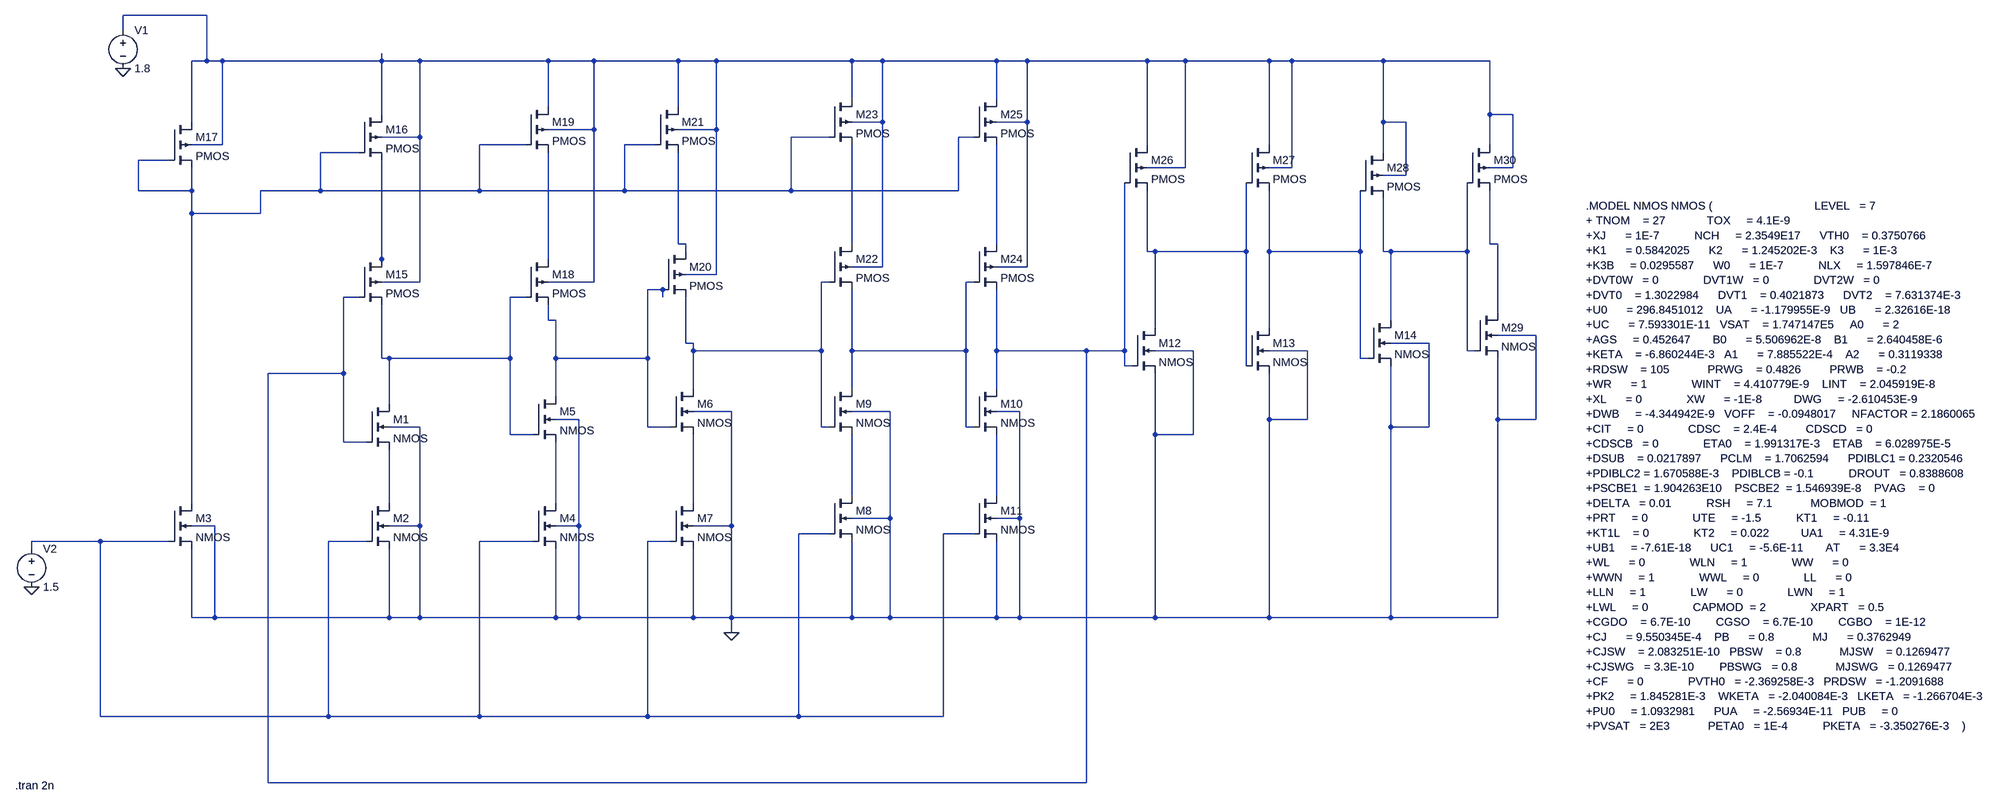
[diagram p0: schematic VLSI_project.asc]
VLSI_project.asc, the LTspice schematic file:
Version 4
SHEET 1 3892 984
WIRE -336 -704 -512 -704
WIRE -512 -672 -512 -704
WIRE -336 -608 -336 -704
WIRE -336 -608 -368 -608
WIRE -304 -608 -336 -608
WIRE 32 -608 32 -624
WIRE 32 -608 -304 -608
WIRE 112 -608 32 -608
WIRE 448 -608 112 -608
WIRE 544 -608 448 -608
WIRE 720 -608 544 -608
WIRE 800 -608 720 -608
WIRE 1088 -608 800 -608
WIRE 1152 -608 1088 -608
WIRE 1408 -608 1152 -608
WIRE 1472 -608 1408 -608
WIRE 1744 -608 1472 -608
WIRE 1824 -608 1744 -608
WIRE 2096 -608 1824 -608
WIRE 2144 -608 2096 -608
WIRE 2400 -608 2144 -608
WIRE 2624 -608 2400 -608
WIRE 1088 -528 1088 -608
WIRE 1408 -528 1408 -608
WIRE 448 -512 448 -608
WIRE 720 -512 720 -608
WIRE 32 -496 32 -608
WIRE 2624 -496 2624 -608
WIRE 2672 -496 2624 -496
WIRE -368 -480 -368 -608
WIRE 1152 -480 1152 -608
WIRE 1152 -480 1088 -480
WIRE 1472 -480 1472 -608
WIRE 1472 -480 1408 -480
WIRE 2400 -480 2400 -608
WIRE 2448 -480 2400 -480
WIRE 544 -464 544 -608
WIRE 544 -464 448 -464
WIRE 800 -464 800 -608
WIRE 800 -464 720 -464
WIRE 112 -448 112 -608
WIRE 112 -448 32 -448
WIRE 1040 -448 960 -448
WIRE 1360 -448 1328 -448
WIRE -304 -432 -304 -608
WIRE -304 -432 -368 -432
WIRE 400 -432 304 -432
WIRE 672 -432 608 -432
WIRE 1744 -432 1744 -608
WIRE 2096 -432 2096 -608
WIRE 2624 -432 2624 -496
WIRE -16 -416 -96 -416
WIRE 2400 -416 2400 -480
WIRE -416 -400 -480 -400
WIRE 1824 -384 1824 -608
WIRE 1824 -384 1744 -384
WIRE 2144 -384 2144 -608
WIRE 2144 -384 2096 -384
WIRE 2672 -384 2672 -496
WIRE 2672 -384 2624 -384
WIRE 2448 -368 2448 -480
WIRE 2448 -368 2400 -368
WIRE -480 -336 -480 -400
WIRE -368 -336 -368 -384
WIRE -368 -336 -480 -336
WIRE -96 -336 -96 -416
WIRE -96 -336 -224 -336
WIRE 304 -336 304 -432
WIRE 304 -336 -96 -336
WIRE 608 -336 608 -432
WIRE 608 -336 304 -336
WIRE 960 -336 960 -448
WIRE 960 -336 608 -336
WIRE 1328 -336 1328 -448
WIRE 1328 -336 960 -336
WIRE -368 -288 -368 -336
WIRE -224 -288 -224 -336
WIRE -224 -288 -368 -288
WIRE 720 -224 720 -416
WIRE 736 -224 720 -224
WIRE 1088 -224 1088 -432
WIRE 1408 -224 1408 -432
WIRE 2624 -224 2624 -336
WIRE 2640 -224 2624 -224
WIRE 736 -208 736 -224
WIRE 1744 -208 1744 -336
WIRE 1760 -208 1744 -208
WIRE 2048 -208 2048 -352
WIRE 2048 -208 1760 -208
WIRE 2096 -208 2096 -336
WIRE 2352 -208 2352 -336
WIRE 2352 -208 2096 -208
WIRE 2400 -208 2400 -320
WIRE 2416 -208 2400 -208
WIRE 2576 -208 2576 -352
WIRE 2576 -208 2416 -208
WIRE 32 -192 32 -400
WIRE 448 -192 448 -416
WIRE 32 -176 32 -192
WIRE 1152 -176 1152 -480
WIRE 1152 -176 1088 -176
WIRE 1472 -176 1472 -480
WIRE 1472 -176 1408 -176
WIRE 800 -160 800 -464
WIRE 800 -160 736 -160
WIRE 112 -144 112 -448
WIRE 112 -144 32 -144
WIRE 544 -144 544 -464
WIRE 544 -144 448 -144
WIRE 1040 -144 1024 -144
WIRE 1360 -144 1344 -144
WIRE 688 -128 656 -128
WIRE -16 -112 -48 -112
WIRE 400 -112 368 -112
WIRE 688 -112 688 -128
WIRE 2640 -80 2640 -224
WIRE 448 -64 448 -96
WIRE 464 -64 448 -64
WIRE 2416 -64 2416 -208
WIRE 1760 -48 1760 -208
WIRE 2096 -48 2096 -208
WIRE 2720 -32 2640 -32
WIRE 736 -16 736 -112
WIRE 752 -16 736 -16
WIRE 2496 -16 2416 -16
WIRE 752 0 752 -16
WIRE 1024 0 1024 -144
WIRE 1024 0 752 0
WIRE 1088 0 1088 -128
WIRE 1344 0 1344 -144
WIRE 1344 0 1088 0
WIRE 1408 0 1408 -128
WIRE 1616 0 1408 0
WIRE 1696 0 1696 -352
WIRE 1696 0 1616 0
WIRE 1840 0 1760 0
WIRE 2176 0 2096 0
WIRE 2576 0 2576 -208
WIRE 2592 0 2576 0
WIRE 32 16 32 -96
WIRE 48 16 32 16
WIRE 368 16 368 -112
WIRE 368 16 48 16
WIRE 464 16 464 -64
WIRE 656 16 656 -128
WIRE 656 16 464 16
WIRE 2352 16 2352 -208
WIRE 2368 16 2352 16
WIRE 1696 32 1696 0
WIRE 1712 32 1696 32
WIRE 2048 32 2048 -208
WIRE -48 48 -48 -112
WIRE -48 48 -208 48
WIRE 752 80 752 0
WIRE 1088 80 1088 0
WIRE 1408 80 1408 0
WIRE 464 96 464 16
WIRE 48 112 48 16
WIRE 832 128 752 128
WIRE 1168 128 1088 128
WIRE 1456 128 1408 128
WIRE 512 144 464 144
WIRE 2096 144 2096 48
WIRE 2176 144 2176 0
WIRE 2176 144 2096 144
WIRE 2640 144 2640 16
WIRE 2720 144 2720 -32
WIRE 2720 144 2640 144
WIRE 112 160 48 160
WIRE 656 160 656 16
WIRE 704 160 656 160
WIRE 1024 160 1024 0
WIRE 1040 160 1024 160
WIRE 1344 160 1344 0
WIRE 1360 160 1344 160
WIRE 2416 160 2416 32
WIRE 2496 160 2496 -16
WIRE 2496 160 2416 160
WIRE 368 176 368 16
WIRE 416 176 368 176
WIRE 1760 176 1760 48
WIRE 1840 176 1840 0
WIRE 1840 176 1760 176
WIRE -48 192 -48 48
WIRE 0 192 -48 192
WIRE 1088 304 1088 176
WIRE 1408 304 1408 176
WIRE -368 320 -368 -288
WIRE 48 320 48 208
WIRE 464 320 464 192
WIRE 752 320 752 176
WIRE 1168 352 1168 128
WIRE 1168 352 1088 352
WIRE 1456 352 1456 128
WIRE 1456 352 1408 352
WIRE -320 368 -368 368
WIRE 112 368 112 160
WIRE 112 368 48 368
WIRE 512 368 512 144
WIRE 512 368 464 368
WIRE 832 368 832 128
WIRE 832 368 752 368
WIRE 1040 384 976 384
WIRE 1360 384 1296 384
WIRE -560 400 -704 400
WIRE -416 400 -560 400
WIRE 0 400 -80 400
WIRE 416 400 304 400
WIRE 704 400 656 400
WIRE -704 416 -704 400
WIRE -368 560 -368 416
WIRE -320 560 -320 368
WIRE -320 560 -368 560
WIRE 48 560 48 416
WIRE 48 560 -320 560
WIRE 112 560 112 368
WIRE 112 560 48 560
WIRE 464 560 464 416
WIRE 464 560 112 560
WIRE 512 560 512 368
WIRE 512 560 464 560
WIRE 752 560 752 416
WIRE 752 560 512 560
WIRE 832 560 832 368
WIRE 832 560 752 560
WIRE 1088 560 1088 400
WIRE 1088 560 832 560
WIRE 1168 560 1168 352
WIRE 1168 560 1088 560
WIRE 1408 560 1408 400
WIRE 1408 560 1168 560
WIRE 1456 560 1456 352
WIRE 1456 560 1408 560
WIRE 1760 560 1760 176
WIRE 1760 560 1456 560
WIRE 2096 560 2096 144
WIRE 2096 560 1760 560
WIRE 2416 560 2416 160
WIRE 2416 560 2096 560
WIRE 2640 560 2640 144
WIRE 2640 560 2416 560
WIRE 832 592 832 560
WIRE -560 768 -560 400
WIRE -80 768 -80 400
WIRE -80 768 -560 768
WIRE 304 768 304 400
WIRE 304 768 -80 768
WIRE 656 768 656 400
WIRE 656 768 304 768
WIRE 976 768 976 384
WIRE 976 768 656 768
WIRE 1296 768 1296 384
WIRE 1296 768 976 768
WIRE -208 960 -208 48
WIRE 1616 960 1616 0
WIRE 1616 960 -208 960
FLAG -704 496 0
FLAG -512 -592 0
FLAG 832 592 0
SYMBOL nmos4 0 112 R0
SYMATTR InstName M1
SYMATTR Value2 l=180n w=180n
SYMBOL nmos4 0 320 R0
SYMATTR InstName M2
SYMATTR Value2 l=180n w=180n
SYMBOL nmos4 -416 320 R0
SYMATTR InstName M3
SYMATTR Value2 l=180n w=180n
SYMBOL nmos4 416 320 R0
SYMATTR InstName M4
SYMATTR Value2 l=180n w=180n
SYMBOL nmos4 416 96 R0
SYMATTR InstName M5
SYMATTR Value2 l=180n w=180n
SYMBOL nmos4 704 80 R0
SYMATTR InstName M6
SYMATTR Value2 l=180n w=180n
SYMBOL nmos4 704 320 R0
SYMATTR InstName M7
SYMATTR Value2 l=180n w=180n
SYMBOL nmos4 1040 304 R0
SYMATTR InstName M8
SYMATTR Value2 l=180n w=180n
SYMBOL nmos4 1040 80 R0
SYMATTR InstName M9
SYMATTR Value2 l=180n w=180n
SYMBOL nmos4 1360 80 R0
SYMATTR InstName M10
SYMATTR Value2 l=180n w=180n
SYMBOL nmos4 1360 304 R0
SYMATTR InstName M11
SYMATTR Value2 l=180n w=180n
SYMBOL nmos4 1712 -48 R0
SYMATTR InstName M12
SYMATTR Value2 l=180n w=180n
SYMBOL nmos4 2048 -48 R0
SYMATTR InstName M13
SYMATTR Value2 l=180n w=180n
SYMBOL nmos4 2368 -64 R0
SYMATTR InstName M14
SYMATTR Value2 l=180n w=180n
SYMBOL pmos4 -16 -192 R0
SYMATTR InstName M15
SYMATTR Value2 l=180n w=450n
SYMBOL pmos4 -16 -496 R0
SYMATTR InstName M16
SYMATTR Value2 l=180n w=450n
SYMBOL pmos4 -416 -480 R0
SYMATTR InstName M17
SYMATTR Value2 l=180n w=450n
SYMBOL pmos4 400 -192 R0
SYMATTR InstName M18
SYMATTR Value2 l=180n w=450n
SYMBOL pmos4 400 -512 R0
SYMATTR InstName M19
SYMATTR Value2 l=180n w=450n
SYMBOL pmos4 688 -208 R0
SYMATTR InstName M20
SYMATTR Value2 l=180n w=450n
SYMBOL pmos4 672 -512 R0
SYMATTR InstName M21
SYMATTR Value2 l=180n w=450n
SYMBOL pmos4 1040 -224 R0
SYMATTR InstName M22
SYMBOL pmos4 1040 -528 R0
SYMATTR InstName M23
SYMATTR Value2 l=180n w=450n
SYMBOL pmos4 1360 -224 R0
SYMATTR InstName M24
SYMATTR Value2 l=180n w=450n
SYMBOL pmos4 1360 -528 R0
SYMATTR InstName M25
SYMATTR Value2 l=180n w=450n
SYMBOL pmos4 1696 -432 R0
SYMATTR InstName M26
SYMATTR Value2 l=180n w=450n
SYMBOL pmos4 2048 -432 R0
SYMATTR InstName M27
SYMATTR Value2 l=180n w=450n
SYMBOL pmos4 2352 -416 R0
SYMATTR InstName M28
SYMATTR Value2 l=180n w=450n
SYMBOL voltage -512 -688 R0
WINDOW 123 0 0 Left 0
WINDOW 39 0 0 Left 0
SYMATTR InstName V1
SYMATTR Value 1.8
SYMBOL voltage -704 400 R0
WINDOW 123 0 0 Left 0
WINDOW 39 0 0 Left 0
SYMATTR InstName V2
SYMATTR Value 1.5
SYMBOL nmos4 2592 -80 R0
SYMATTR InstName M29
SYMATTR Value2 l=180n w=180n
SYMBOL pmos4 2576 -432 R0
SYMATTR InstName M30
SYMATTR Value2 l=180n w=450n
TEXT -738 966 Left 2 !.tran 2n
TEXT 3000 -304 Left 2 !.MODEL NMOS NMOS (                                LEVEL   = 7\n+ TNOM    = 27             TOX     = 4.1E-9  \n+XJ      = 1E-7           NCH     = 2.3549E17      VTH0    = 0.3750766\n+K1      = 0.5842025      K2      = 1.245202E-3    K3      = 1E-3\n+K3B     = 0.0295587      W0      = 1E-7           NLX     = 1.597846E-7\n+DVT0W   = 0              DVT1W   = 0              DVT2W   = 0\n+DVT0    = 1.3022984      DVT1    = 0.4021873      DVT2    = 7.631374E-3\n+U0      = 296.8451012    UA      = -1.179955E-9   UB      = 2.32616E-18\n+UC      = 7.593301E-11   VSAT    = 1.747147E5     A0      = 2\n+AGS     = 0.452647       B0      = 5.506962E-8    B1      = 2.640458E-6\n+KETA    = -6.860244E-3   A1      = 7.885522E-4    A2      = 0.3119338\n+RDSW    = 105            PRWG    = 0.4826         PRWB    = -0.2\n+WR      = 1              WINT    = 4.410779E-9    LINT    = 2.045919E-8\n+XL      = 0              XW      = -1E-8          DWG     = -2.610453E-9\n+DWB     = -4.344942E-9   VOFF    = -0.0948017     NFACTOR = 2.1860065\n+CIT     = 0              CDSC    = 2.4E-4         CDSCD   = 0\n+CDSCB   = 0              ETA0    = 1.991317E-3    ETAB    = 6.028975E-5\n+DSUB    = 0.0217897      PCLM    = 1.7062594      PDIBLC1 = 0.2320546\n+PDIBLC2 = 1.670588E-3    PDIBLCB = -0.1           DROUT   = 0.8388608\n+PSCBE1  = 1.904263E10    PSCBE2  = 1.546939E-8    PVAG    = 0\n+DELTA   = 0.01           RSH     = 7.1            MOBMOD  = 1\n+PRT     = 0              UTE     = -1.5           KT1     = -0.11\n+KT1L    = 0              KT2     = 0.022          UA1     = 4.31E-9\n+UB1     = -7.61E-18      UC1     = -5.6E-11       AT      = 3.3E4\n+WL      = 0              WLN     = 1              WW      = 0\n+WWN     = 1              WWL     = 0              LL      = 0\n+LLN     = 1              LW      = 0              LWN     = 1\n+LWL     = 0              CAPMOD  = 2              XPART   = 0.5\n+CGDO    = 6.7E-10        CGSO    = 6.7E-10        CGBO    = 1E-12\n+CJ      = 9.550345E-4    PB      = 0.8            MJ      = 0.3762949\n+CJSW    = 2.083251E-10   PBSW    = 0.8            MJSW    = 0.1269477\n+CJSWG   = 3.3E-10        PBSWG   = 0.8            MJSWG   = 0.1269477\n+CF      = 0              PVTH0   = -2.369258E-3   PRDSW   = -1.2091688\n+PK2     = 1.845281E-3    WKETA   = -2.040084E-3   LKETA   = -1.266704E-3\n+PU0     = 1.0932981      PUA     = -2.56934E-11   PUB     = 0\n+PVSAT   = 2E3            PETA0   = 1E-4           PKETA   = -3.350276E-3    )

The netlist it stands for:
* VLSI_project.asc
M1 N016 N015 N019 0 NMOS l=180n w=180n
M2 N019 N022 0 0 NMOS l=180n w=180n
M3 N002 N022 0 0 NMOS l=180n w=180n
M4 N020 N022 0 0 NMOS l=180n w=180n
M5 N014 N016 N020 0 NMOS l=180n w=180n
M6 N012 N014 N021 0 NMOS l=180n w=180n
M7 N021 N022 0 0 NMOS l=180n w=180n
M8 N017 N022 0 0 NMOS l=180n w=180n
M9 N013 N012 N017 0 NMOS l=180n w=180n
M10 N015 N013 N018 0 NMOS l=180n w=180n
M11 N018 N022 0 0 NMOS l=180n w=180n
M12 N007 N015 0 0 NMOS l=180n w=180n
M13 N008 N007 0 0 NMOS l=180n w=180n
M14 N009 N008 0 0 NMOS l=180n w=180n
M15 N010 N015 N016 N001 PMOS l=180n w=450n
M16 N001 N002 N010 N001 PMOS l=180n w=450n
M17 N001 N002 N002 N001 PMOS l=180n w=450n
M18 N011 N016 N014 N001 PMOS l=180n w=450n
M19 N001 N002 N011 N001 PMOS l=180n w=450n
M20 N003 N014 N012 N001 PMOS l=180n w=450n
M21 N001 N002 N003 N001 PMOS l=180n w=450n
M22 N004 N012 N013 N001 PMOS
M23 N001 N002 N004 N001 PMOS l=180n w=450n
M24 N005 N013 N015 N001 PMOS l=180n w=450n
M25 N001 N002 N005 N001 PMOS l=180n w=450n
M26 N001 N015 N007 N001 PMOS l=180n w=450n
M27 N001 N007 N008 N001 PMOS l=180n w=450n
M28 N001 N008 N009 N001 PMOS l=180n w=450n
V1 N001 0 1.8
V2 N022 0 1.5
M29 N006 N009 0 0 NMOS l=180n w=180n
M30 N001 N009 N006 N001 PMOS l=180n w=450n
.model NMOS NMOS
.model PMOS PMOS
.lib standard.mos
.tran 2n
.MODEL NMOS NMOS (                                LEVEL   = 7
+ TNOM    = 27             TOX     = 4.1E-9
+XJ      = 1E-7           NCH     = 2.3549E17      VTH0    = 0.3750766
+K1      = 0.5842025      K2      = 1.245202E-3    K3      = 1E-3
+K3B     = 0.0295587      W0      = 1E-7           NLX     = 1.597846E-7
+DVT0W   = 0              DVT1W   = 0              DVT2W   = 0
+DVT0    = 1.3022984      DVT1    = 0.4021873      DVT2    = 7.631374E-3
+U0      = 296.8451012    UA      = -1.179955E-9   UB      = 2.32616E-18
+UC      = 7.593301E-11   VSAT    = 1.747147E5     A0      = 2
+AGS     = 0.452647       B0      = 5.506962E-8    B1      = 2.640458E-6
+KETA    = -6.860244E-3   A1      = 7.885522E-4    A2      = 0.3119338
+RDSW    = 105            PRWG    = 0.4826         PRWB    = -0.2
+WR      = 1              WINT    = 4.410779E-9    LINT    = 2.045919E-8
+XL      = 0              XW      = -1E-8          DWG     = -2.610453E-9
+DWB     = -4.344942E-9   VOFF    = -0.0948017     NFACTOR = 2.1860065
+CIT     = 0              CDSC    = 2.4E-4         CDSCD   = 0
+CDSCB   = 0              ETA0    = 1.991317E-3    ETAB    = 6.028975E-5
+DSUB    = 0.0217897      PCLM    = 1.7062594      PDIBLC1 = 0.2320546
+PDIBLC2 = 1.670588E-3    PDIBLCB = -0.1           DROUT   = 0.8388608
+PSCBE1  = 1.904263E10    PSCBE2  = 1.546939E-8    PVAG    = 0
+DELTA   = 0.01           RSH     = 7.1            MOBMOD  = 1
+PRT     = 0              UTE     = -1.5           KT1     = -0.11
+KT1L    = 0              KT2     = 0.022          UA1     = 4.31E-9
+UB1     = -7.61E-18      UC1     = -5.6E-11       AT      = 3.3E4
+WL      = 0              WLN     = 1              WW      = 0
+WWN     = 1              WWL     = 0              LL      = 0
+LLN     = 1              LW      = 0              LWN     = 1
+LWL     = 0              CAPMOD  = 2              XPART   = 0.5
+CGDO    = 6.7E-10        CGSO    = 6.7E-10        CGBO    = 1E-12
+CJ      = 9.550345E-4    PB      = 0.8            MJ      = 0.3762949
+CJSW    = 2.083251E-10   PBSW    = 0.8            MJSW    = 0.1269477
+CJSWG   = 3.3E-10        PBSWG   = 0.8            MJSWG   = 0.1269477
+CF      = 0              PVTH0   = -2.369258E-3   PRDSW   = -1.2091688
+PK2     = 1.845281E-3    WKETA   = -2.040084E-3   LKETA   = -1.266704E-3
+PU0     = 1.0932981      PUA     = -2.56934E-11   PUB     = 0
+PVSAT   = 2E3            PETA0   = 1E-4           PKETA   = -3.350276E-3    )
.backanno
.end